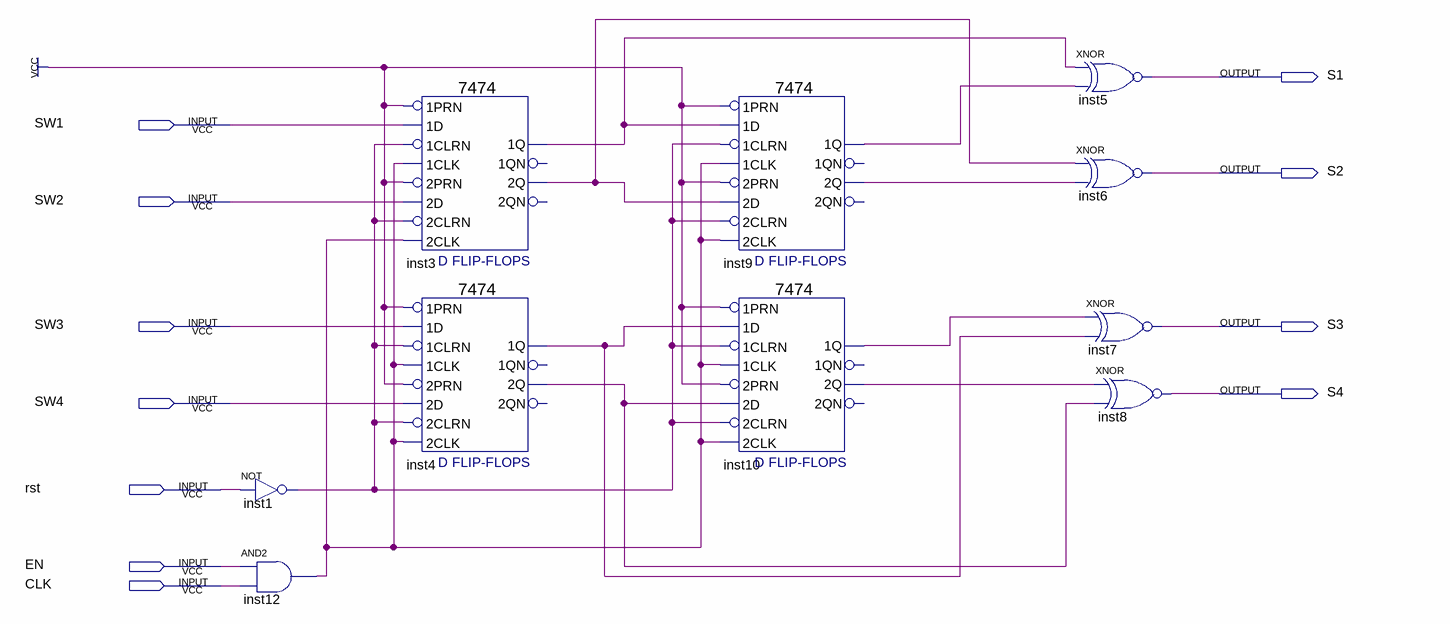
[diagram p0: schematic sheet]
// Quartus schematic TestReg.bdf as structural Verilog: 10 symbols, 11 pins
module TestReg (
  input  SW1,
  input  SW2,
  input  SW3,
  input  SW4,
  input  rst,
  input  EN,
  input  CLK,
  output S1,
  output S2,
  output S3,
  output S4
);

  wire inst1_out, inst3_1q, inst3_2q, inst4_1q, inst4_2q, inst9_1q, inst9_2q, inst10_1q, inst10_2q,
       inst12_out;

  not inst1 (inst1_out, rst);
  and inst12 (inst12_out, EN, CLK);
  \7474  inst3 (
    .\2D (SW2), .\2PRN (1'b1), .\1CLK (inst12_out), .\1D (SW1), .\1PRN (1'b1), .\2CLK (inst12_out),
    .\2CLRN (inst1_out), .\1CLRN (inst1_out), .\2Q (inst3_2q), .\1Q (inst3_1q));  // open: 1QN, 2QN
  \7474  inst4 (
    .\2D (SW4), .\2PRN (1'b1), .\1CLK (inst12_out), .\1D (SW3), .\1PRN (1'b1), .\2CLK (inst12_out),
    .\2CLRN (inst1_out), .\1CLRN (inst1_out), .\2Q (inst4_2q), .\1Q (inst4_1q));  // open: 1QN, 2QN
  \7474  inst9 (
    .\2D (inst3_2q), .\2PRN (1'b1), .\1CLK (inst12_out), .\1D (inst3_1q), .\1PRN (1'b1), .\2CLK (inst12_out),
    .\2CLRN (inst1_out), .\1CLRN (inst1_out), .\2Q (inst9_2q), .\1Q (inst9_1q));  // open: 1QN, 2QN
  \7474  inst10 (
    .\2D (inst4_2q), .\2PRN (1'b1), .\1CLK (inst12_out), .\1D (inst4_1q), .\1PRN (1'b1), .\2CLK (inst12_out),
    .\2CLRN (inst1_out), .\1CLRN (inst1_out), .\2Q (inst10_2q), .\1Q (inst10_1q));  // open: 1QN, 2QN
  xnor inst5 (S1, inst3_1q, inst9_1q);
  xnor inst6 (S2, inst3_2q, inst9_2q);
  xnor inst7 (S3, inst10_1q, inst4_1q);
  xnor inst8 (S4, inst10_2q, inst4_2q);
endmodule
